# Altium project Serial_Sniffer.PrjPcb
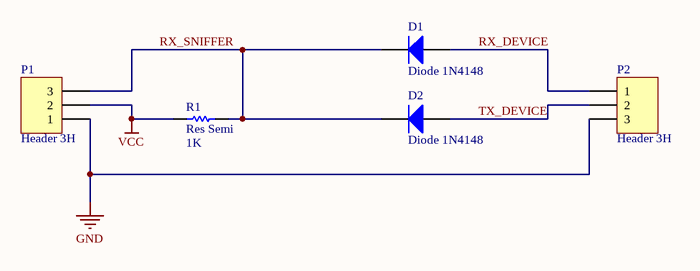
[diagram p0: Serial_Sniffer.SchDoc]
1 sheet, 5 parts. Net scope: global (net labels, ports and power ports of the same name join across sheets).
Board file: Serial_Sniffer.PcbDoc

## Sheet Serial_Sniffer.SchDoc
size A3; DocumentNumber: 3; SheetNumber: 3; SheetTotal: 7

### Parts
D1  Diode 1N4148  [DO-35]
D2  Diode 1N4148  [DO-35]
P1  Header 3H  [HDR1X3H]
P2  Header 3H  [HDR1X3H]
R1  Res Semi  value 1K  [AXIAL-0.5]

### Nets
GND: P1.1 P2.3
VCC: P1.2 R1.1
RX_DEVICE: D1.1(A) P2.1
RX_SNIFFER: D1.2(K) D2.2(K) P1.3 R1.2
TX_DEVICE: D2.1(A) P2.2

### Library data of the parts
D1 D2 = Diode 1N4148: High Conductance Fast Diode; Published: 8-Jun-2000; LatestRevisionDate: 17-Jul-2002; LatestRevisionNote: Re-released for DXP Platform.; DatasheetVersion: 1997; PackageReference: DO-35; Publisher: Altium Limited; PackageDescription: Diode, Axial; Body 3.8 x 1.9 mm (LxDia. max), Lead Dia. 0.53 mm (max); Code_JEDEC: DO-204-AH; ComponentLink1Description: Manufacturer Link; ComponentLink1URL: http://www.fairchildsemi.com/; ComponentLink2Description: Datasheet; ComponentLink2URL: http://www.fairchildsemi.com/ds/1N%2F1N4148.pdf
P1 P2 = Header 3H: Header, 3-Pin, Right Angle; LatestRevisionDate: 17-Jul-2002; LatestRevisionNote: Re-released for DXP Platform.; Publisher: Altium Limited
R1 = Res Semi: Semiconductor Resistor; Published: 8-Jun-2000; LatestRevisionDate: 17-Jul-2002; LatestRevisionNote: Re-released for DXP Platform.; PackageReference: AXIAL-0.5; Publisher: Altium Limited; PackageDescription: Axial Device, Thru-Hole; 2 Leads; 0.5 in Pin Spacing